# Altium schematic sheet Schematic_PBL5.SchDoc
size A; SheetNumber: 1; SheetTotal: 1
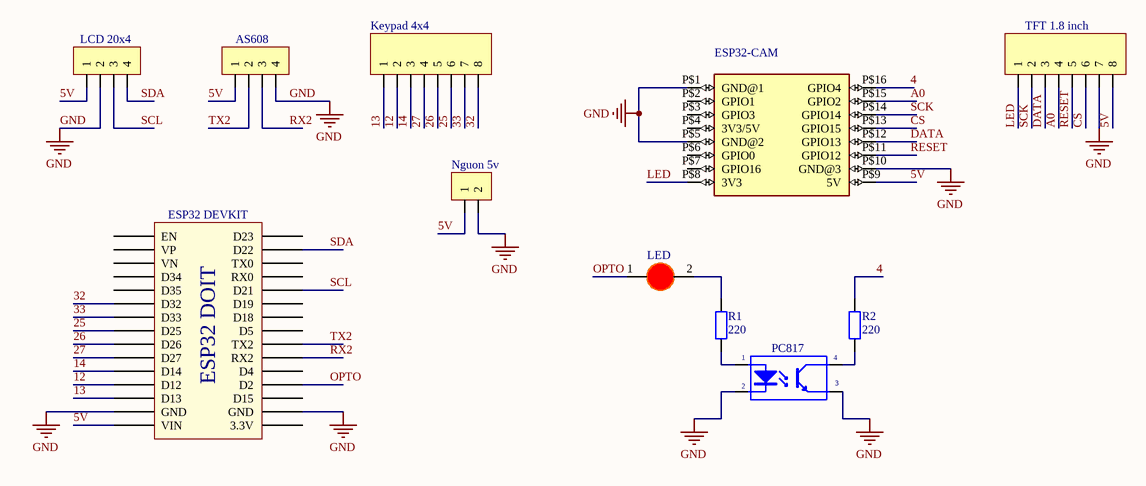
[diagram p0: Schematic_PBL5.SchDoc]

## Parts
AS608  LCD 20x4  [JP 1x4 DT]  (value not drawn)
ESP32_Cam  ESP32-CAM  [ESP32-CAM]  (value not drawn)
ESP32_DEVKIT  ESP32 DEVKIT  [ESP32 WROOM 32 KIT]  (value not drawn)
Keypad_4x4  Keypad 4x4  [JP 1x8 DT]  (value not drawn)
LCD_20x4  LCD 20x4  [JP 1x4 DT]  (value not drawn)
LED  LED 5mm  [LED-5MM-RED]  (value not drawn)
Nguon_5v  JP 1x2 2.54  [JP 1x2 DT]  (value not drawn)
PC817  PC817  [DIP4/W0.3]  (value not drawn)
R1  220  [R1/4W]
R2  220  [R1/4W]
TFT_1.8_inch  TFT 1.8 inch  [JP 1x8 DT]  (value not drawn)

## Nets
GND: AS608.4 ESP32_Cam.P$1(GND@1) ESP32_Cam.P$5(GND@2) ESP32_Cam.P$10(GND@3) ESP32_DEVKIT.14(GND) ESP32_DEVKIT.17(GND) LCD_20x4.2 Nguon_5v.2 PC817.2(K) PC817.3(E) TFT_1.8_inch.7
4: ESP32_Cam.P$16(GPIO4) R2.2
5V: AS608.1 ESP32_Cam.P$9(5V) ESP32_DEVKIT.15(VIN) LCD_20x4.1 Nguon_5v.1 TFT_1.8_inch.8
12: ESP32_DEVKIT.12(D12) Keypad_4x4.2
13: ESP32_DEVKIT.13(D13) Keypad_4x4.1
14: ESP32_DEVKIT.11(D14) Keypad_4x4.3
25: ESP32_DEVKIT.8(D25) Keypad_4x4.6
26: ESP32_DEVKIT.9(D26) Keypad_4x4.5
27: ESP32_DEVKIT.10(D27) Keypad_4x4.4
32: ESP32_DEVKIT.6(D32) Keypad_4x4.8
33: ESP32_DEVKIT.7(D33) Keypad_4x4.7
A0: ESP32_Cam.P$15(GPIO2) TFT_1.8_inch.4
CS: ESP32_Cam.P$13(GPIO15) TFT_1.8_inch.6
DATA: ESP32_Cam.P$12(GPIO13) TFT_1.8_inch.3
LED: ESP32_Cam.P$8(3V3) TFT_1.8_inch.1
OPTO: ESP32_DEVKIT.19(D2) LED.1(A)
RESET: ESP32_Cam.P$11(GPIO12) TFT_1.8_inch.5
RX2: AS608.3 ESP32_DEVKIT.21(RX2)
SCK: ESP32_Cam.P$14(GPIO14) TFT_1.8_inch.2
SCL: ESP32_DEVKIT.26(D21) LCD_20x4.3
SDA: ESP32_DEVKIT.29(D22) LCD_20x4.4
TX2: AS608.2 ESP32_DEVKIT.22(TX2)
NetLED_2: LED.2(K) R1.2
NetPC817_1: PC817.1(A) R1.1
NetPC817_4: PC817.4(C) R2.1

Not connected (* = marked no-connect by the designer): ESP32_Cam P$2(GPIO1) P$3(GPIO3) P$4(3V3/5V) P$6(GPIO0) P$7(GPIO16); ESP32_DEVKIT 1(EN) 2(VP) 3(VN) 4(D34) 5(D35) 16(3.3V) 18(D15) 20(D4) 23(D5) 24(D18) 25(D19) 27(RX0) 28(TX0) 30(D23)

## Notes on the sheet
- (in symbol ESP32 WROOM 32 KIT) ESP32 DOIT

## Library data of the parts
AS608 LCD_20x4 = JP 1x4 2.54 Duc Thang: Cắm; Ten_Linh_Kien: Jump Đơn Đực 2.54MM 1x40P Thẳng 11MM; Don_Vi: Con; Ma_Hang: MH000903; Ghi_Chu: *; Kieu_Chan: *; Chung_Loai: Cắm
ESP32_Cam = ESP32-CAM: ESP32 ESP32 Transceiver; 802.11 a/b/g/n (Wi-Fi, WiFi, WLAN), BluetoothÂ® Smart 4.x Low Energy (BLE) Evaluation Board; MF: AI-Thinker; SnapEDA_Link: https://www.snapeda.com/parts/ESP32-CAM/AI-Thinker/view-part/?ref=snap; Package: None; Value: *; MP: ESP32-CAM; Check_prices: https://www.snapeda.com/parts/ESP32-CAM/AI-Thinker/view-part/?ref=eda
ESP32_DEVKIT = ESP32 WROOM 32 KIT
Keypad_4x4 TFT_1.8_inch = JP 1x8 2.54 Duc Thang: Cắm; Ten_Linh_Kien: Jump Đơn Đực 2.54MM 1x40P Thẳng 11MM; Don_Vi: Con; Ma_Hang: MH000903; Ghi_Chu: *; Kieu_Chan: *; Chung_Loai: Cắm
LED = LED 5mm Do: Cắm; Don_Vi: Con; Ma_Hang: MH008967; Ten_Linh_Kien: Led 5MM Phủ Đỏ (1000c); Ghi_Chu: *; Kieu_Chan: *; Chung_Loai: Cắm
Nguon_5v = JP 1x2 2.54 Duc Thang: Cắm; Ten_Linh_Kien: Jump Đơn Đực 2.54MM 1x40P Thẳng 11MM; Don_Vi: Con; Ma_Hang: MH000903; Ghi_Chu: *; Kieu_Chan: *; Chung_Loai: Cắm
PC817 = PC817: Single Opto; Value: PC817
R1 R2 = R1/4W: Resistor 1/4W; Value: R1/4W - 1K